# EAGLE design SBC (EAGLE 6.3)
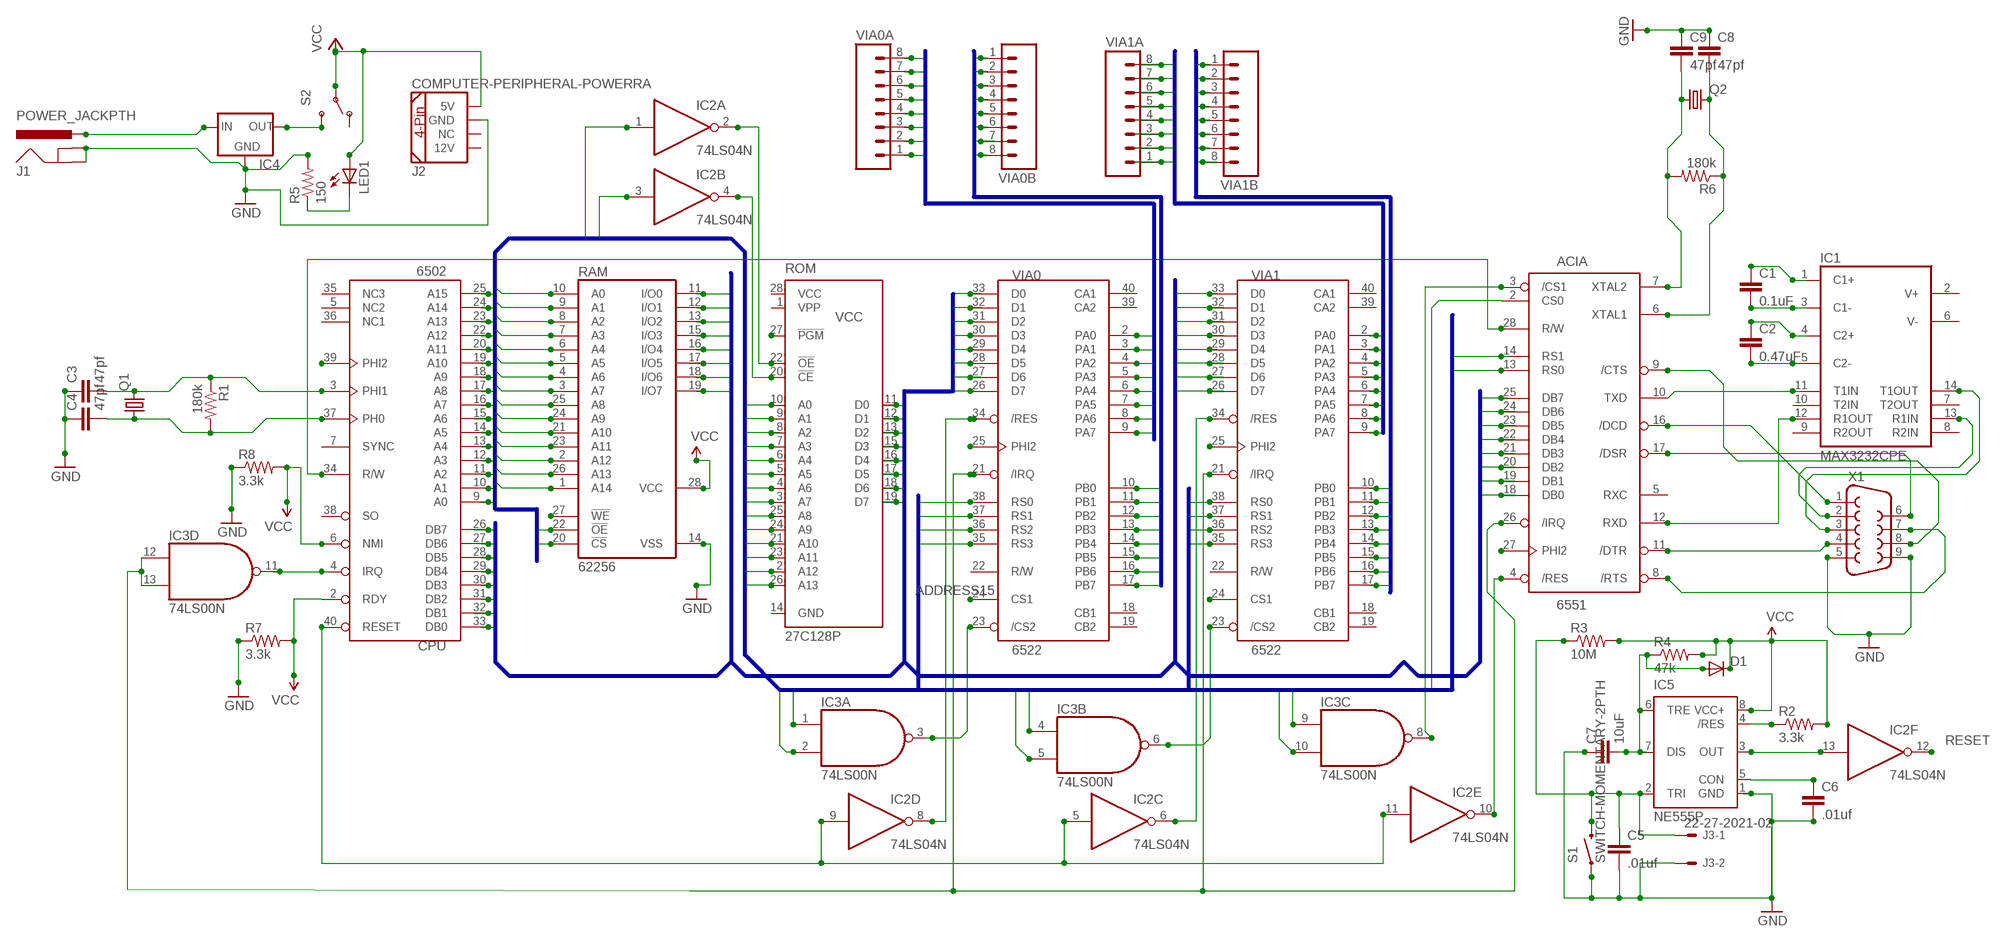
[diagram p0: schematic, sheet 1]

## Parts
ACIA  6551  [DIP28]
C1  0.1uF  CAPKIT  [CAP-PTH-SMALL-KIT]
C2  0.47uF  CAPKIT  [CAP-PTH-SMALL-KIT]
C3  47pf  CAPEZ  [CAP-PTH-SMALLEZ]
C4  47pf  CAPEZ  [CAP-PTH-SMALLEZ]
C5  .01uf  CAPEZ  [CAP-PTH-SMALLEZ]
C6  .01uf  CAPEZ  [CAP-PTH-SMALLEZ]
C7  10uF  CAPEZ  [CAP-PTH-SMALLEZ]
C8  47pf  CAPEZ  [CAP-PTH-SMALLEZ]
C9  47pf  CAPEZ  [CAP-PTH-SMALLEZ]
CPU  6502  [DIP40]
D1  DIODE1N4148  [DIODE-1N4148]
IC1  MAX3232CPE  [DIL16]
IC2  74LS04N  [DIL14]
IC3  74LS00N  [DIL14]
IC4  V_REG_78XX-TO-220  [TO-220-ALT]
IC5  NE555P  [DIL-08]
J1  POWER_JACKPTH  [POWER_JACK_PTH]
J2  COMPUTER-PERIPHERAL-POWERRA  [COMPUTER-PERIPHERAL-POWER-RA]
J3  22-27-2021-02  [6410-02]
LED1  LED3MM  [LED3MM]
Q1  CRYSTALHC49S  [HC49/S]
Q2  CRYSTALHC49S  [HC49/S]
R1  180k  RESISTOREZ  [AXIAL-0.3EZ]
R2  3.3k  RESISTORAXIAL-0.3  [AXIAL-0.3]
R3  10M  RESISTORAXIAL-0.3  [AXIAL-0.3]
R4  47k  RESISTORAXIAL-0.3  [AXIAL-0.3]
R5  150  RESISTOREZ  [AXIAL-0.3EZ]
R6  180k  RESISTOREZ  [AXIAL-0.3EZ]
R7  3.3k  RESISTOREZ  [AXIAL-0.3EZ]
R8  3.3k  RESISTOREZ  [AXIAL-0.3EZ]
RAM  62256  62256P  [DIL28-6]
ROM  27C128P  [DIL28-6]
S1  SWITCH-MOMENTARY-2PTH  [TACTILE-PTH]
S2  SWITCH-SPDTPTH_LOCK  [SWITCH-SPDT_LOCK.007S]
VIA0  6522  [DIP40]
VIA0A  M08LONGPADS  [1X08_LONGPADS]
VIA0B  M08LONGPADS  [1X08_LONGPADS]
VIA1  6522  [DIP40]
VIA1A  M08LONGPADS  [1X08_LONGPADS]
VIA1B  M08LONGPADS  [1X08_LONGPADS]
X1  DB9FEMALE  [DB9]

## Nets
65IRQ: CPU.4(IRQ) IC3.11(D:O)
ADDRESS0: ACIA.13(RS0) CPU.9(A0) RAM.10(A0) ROM.10(A0) VIA0.38(RS0) VIA1.38(RS0)
ADDRESS1: ACIA.14(RS1) CPU.10(A1) RAM.9(A1) ROM.9(A1) VIA0.37(RS1) VIA1.37(RS1)
ADDRESS2: CPU.11(A2) RAM.8(A2) ROM.8(A2) VIA0.36(RS2) VIA1.36(RS2)
ADDRESS3: CPU.12(A3) RAM.7(A3) ROM.7(A3) VIA0.35(RS3) VIA1.35(RS3)
ADDRESS4: CPU.13(A4) RAM.6(A4) ROM.6(A4)
ADDRESS5: CPU.14(A5) RAM.5(A5) ROM.5(A5)
ADDRESS6: CPU.15(A6) RAM.4(A6) ROM.4(A6)
ADDRESS7: CPU.16(A7) RAM.3(A7) ROM.3(A7)
ADDRESS8: CPU.17(A8) RAM.25(A8) ROM.25(A8)
ADDRESS9: CPU.18(A9) IC3.10(C:I1) RAM.24(A9) ROM.24(A9)
ADDRESS10: CPU.19(A10) IC3.5(B:I1) RAM.21(A10) ROM.21(A10)
ADDRESS11: CPU.20(A11) IC3.2(A:I1) RAM.23(A11) ROM.23(A11)
ADDRESS12: CPU.22(A12) IC3.1(A:I0) IC3.4(B:I0) IC3.9(C:I0) RAM.2(A12) ROM.2(A12)
ADDRESS13: CPU.23(A13) IC2.1(A:I) RAM.26(A13) ROM.26(A13)
ADDRESS14: CPU.24(A14) RAM.1(A14)
ADDRESS15: ACIA.2(CS0) CPU.25(A15) IC2.3(B:I) RAM.20(!CS) RAM.22(!OE) VIA0.24(CS1) VIA1.24(CS1)
CLEARTOSEND: ACIA.9(/CTS) X1.8
DATA0: ACIA.18(DB0) CPU.33(DB0) RAM.11(I/O0) ROM.11(D0) VIA0.33(D0) VIA1.33(D0)
DATA1: ACIA.19(DB1) CPU.32(DB1) RAM.12(I/O1) ROM.12(D1) VIA0.32(D1) VIA1.32(D1)
DATA2: ACIA.20(DB2) CPU.31(DB2) RAM.13(I/O2) ROM.13(D2) VIA0.31(D2) VIA1.31(D2)
DATA3: ACIA.21(DB3) CPU.30(DB3) RAM.15(I/O3) ROM.15(D3) VIA0.30(D3) VIA1.30(D3)
DATA4: ACIA.22(DB4) CPU.29(DB4) RAM.16(I/O4) ROM.16(D4) VIA0.29(D4) VIA1.29(D4)
DATA5: ACIA.23(DB5) CPU.28(DB5) RAM.17(I/O5) ROM.17(D5) VIA0.28(D5) VIA1.28(D5)
DATA6: ACIA.24(DB6) CPU.27(DB6) RAM.18(I/O6) ROM.18(D6) VIA0.27(D6) VIA1.27(D6)
DATA7: ACIA.25(DB7) CPU.26(DB7) RAM.19(I/O7) ROM.19(D7) VIA0.26(D7) VIA1.26(D7)
DATACARRIERDETECT: ACIA.16(/DCD) X1.1
DATASETREADY: ACIA.17(/DSR) X1.6
DTEREADY: ACIA.11(/DTR) X1.4
GND: C3.1 C4.1 C5.2 C6.2 C7.1 C8.1 C9.1 IC4.GND IC5.1(GND) J1.GND J1.GNDBREAK J2.GND J3.2 R5.P$2 R7.P$1 R8.P$1 RAM.14(VSS) S1.1 X1.5 X1.9
IRQ: ACIA.26(/IRQ) IC3.12(D:I0) IC3.13(D:I1) VIA0.21(/IRQ) VIA1.21(/IRQ)
N$1: LED1.K(C) R5.P$1
N$2: C3.2 CPU.3(PHI1) Q1.2 R1.P$1
N$3: IC1.14(T1OUT) X1.3
N$5: ACIA.28(R/W) CPU.34(R/W)
N$6: C5.1 IC5.2(TRI) J3.1 R3.P$1 S1.3
N$7: ACIA.10(TXD) IC1.11(T1IN)
N$8: ACIA.12(RXD) IC1.12(R1OUT)
N$9: C1.2 IC1.3(C1-)
N$10: C1.1 IC1.1(C1+)
N$11: C2.2 IC1.5(C2-)
N$12: C2.1 IC1.4(C2+)
N$13: IC2.4(B:O) ROM.20(!CE)
N$14: IC2.2(A:O) ROM.22(!OE)
N$15: IC3.6(B:O) VIA1.23(/CS2)
N$16: ACIA.3(/CS1) IC3.8(C:O)
N$17: IC3.3(A:O) VIA0.23(/CS2)
N$18: C4.2 CPU.37(PH0) Q1.1 R1.P$2
N$19: C6.1 IC5.5(CON)
N$20: IC4.IN J1.PWR
N$21: IC2.8(D:O) VIA0.34(/RES)
N$22: C7.2 D1.A IC5.6(TRE) IC5.7(DIS) R4.P$1
N$23: IC5.4(/RES) R2.P$1
N$24: IC2.6(C:O) VIA1.34(/RES)
N$26: ACIA.4(/RES) IC2.10(E:O)
N$29: IC2.13(F:I) IC5.3(OUT)
N$30: ACIA.6(XTAL1) C8.2 Q2.2 R6.P$1
N$31: ACIA.7(XTAL2) C9.2 Q2.1 R6.P$2
N$32: IC4.OUT S2.3(S)
PHI2: ACIA.27(PHI2) CPU.39(PHI2) RAM.27(!WE) VIA0.25(PHI2) VIA1.25(PHI2)
RECEIVEDATA: IC1.13(R1IN) X1.2
REQUESTTOSEND: ACIA.8(/RTS) X1.7
RESET: CPU.40(RESET) IC2.5(C:I) IC2.9(D:I) IC2.11(E:I) IC2.12(F:O)
VCC: CPU.2(RDY) CPU.6(NMI) D1.C IC5.8(VCC+) J2.5V LED1.A R2.P$2 R3.P$2 R4.P$2 R7.P$2 R8.P$2 RAM.28(VCC) ROM.27(!PGM) S2.2(P)
VIA0A0: VIA0.2(PA0) VIA0A.1
VIA0A1: VIA0.3(PA1) VIA0A.2
VIA0A2: VIA0.4(PA2) VIA0A.3
VIA0A3: VIA0.5(PA3) VIA0A.4
VIA0A4: VIA0.6(PA4) VIA0A.5
VIA0A5: VIA0.7(PA5) VIA0A.6
VIA0A6: VIA0.8(PA6) VIA0A.7
VIA0A7: VIA0.9(PA7) VIA0A.8
VIA0B0: VIA0.10(PB0) VIA0B.1
VIA0B1: VIA0.11(PB1) VIA0B.2
VIA0B2: VIA0.12(PB2) VIA0B.3
VIA0B3: VIA0.13(PB3) VIA0B.4
VIA0B4: VIA0.14(PB4) VIA0B.5
VIA0B5: VIA0.15(PB5) VIA0B.6
VIA0B6: VIA0.16(PB6) VIA0B.7
VIA0B7: VIA0.17(PB7) VIA0B.8
VIA1A0: VIA1.2(PA0) VIA1A.1
VIA1A1: VIA1.3(PA1) VIA1A.2
VIA1A2: VIA1.4(PA2) VIA1A.3
VIA1A3: VIA1.5(PA3) VIA1A.4
VIA1A4: VIA1.6(PA4) VIA1A.5
VIA1A5: VIA1.7(PA5) VIA1A.6
VIA1A6: VIA1.8(PA6) VIA1A.7
VIA1A7: VIA1.9(PA7) VIA1A.8
VIA1B0: VIA1.10(PB0) VIA1B.1
VIA1B1: VIA1.11(PB1) VIA1B.2
VIA1B2: VIA1.12(PB2) VIA1B.3
VIA1B3: VIA1.13(PB3) VIA1B.4
VIA1B4: VIA1.14(PB4) VIA1B.5
VIA1B5: VIA1.15(PB5) VIA1B.6
VIA1B6: VIA1.16(PB6) VIA1B.7
VIA1B7: VIA1.17(PB7) VIA1B.8
Unconnected: ACIA.5(RXC) CPU.5(NC2) CPU.7(SYNC) CPU.35(NC3) CPU.36(NC1) CPU.38(SO) IC1.2(V+) IC1.6(V-) IC1.7(T2OUT) IC1.8(R2IN) IC1.9(R2OUT) IC1.10(T2IN) J2.12V J2.NC ROM.1(VPP) S2.1(O) VIA0.18(CB1) VIA0.19(CB2) VIA0.22(R/W) VIA0.39(CA2) VIA0.40(CA1) VIA1.18(CB1) VIA1.19(CB2) VIA1.22(R/W) VIA1.39(CA2) VIA1.40(CA1)

## Buses
VIA0A[0..7]
VIA0B[0..7]
VIA1A[0..7]
VIA1B[0..7]
ADDRESS[0..15]
DATA[0..7]

## Power pins joined to a net without a drawn wire
GND: ACIA.1(GND) CPU.1(GND) CPU.21(GND) IC1.15(GND) IC2.7(P:GND) IC3.7(P:GND) ROM.14(GND) VIA0.1(GND) VIA1.1(GND)
VCC: ACIA.15(VCC) CPU.8(VCC) IC1.16(VCC) IC2.14(P:VCC) IC3.14(P:VCC) ROM.28(VCC) VIA0.20(VCC) VIA1.20(VCC)

## Library data of the parts
ACIA = 0RB_65xx:6551: ACIA. Capable of RS-232
C1-C9 = SparkFun-Capacitors:CAP: Capacitor Standard 0603 ceramic capacitor, and 0.1" leaded capacitor.
CPU = 0RB_65xx:6502: 6502 processor
D1 = SparkFun-DiscreteSemi:DIODE: Diode These are standard reverse protection diodes and small signal diodes. SMA package can handle up to about 1A. SOD-323 can handle about 200mA. What the SOD-323 package when ordering, there are some mfgs out there that are 5-pin packages.
IC1 = maxim:MAX3232*: True RS-232 Transceivers 3.0V to 5.5V, Low-Power up to 1Mbps, Using Four 0.1µF External Capacitors Source: http://pdfserv.maxim-ic.com/en/ds/MAX3222-MAX3241.pdf; MF: MAXIM; MPN: MAX3232CPE+; OC_FARNELL: 9724494; OC_NEWARK: 68K4626
IC2 = 74xx-us:74*04: Hex INVERTER
IC3 = 74xx-us:74*00: Quad 2-input NAND gate
IC4 = SparkFun-PowerIC:V_REG_78XX: Voltage Regulator Standard 7805 5V regulator. IGO (Input Ground Output). Spark Fun Electronics SKU : COM-00107
IC5 = SparkFun-AnalogIC:NE555: General purpose bipolar Timer; MF: Arrow Electronics; MPN: NE555N; OC_FARNELL: 1467742; OC_NEWARK: 89K1486
J1 = SparkFun-Connectors:POWER_JACK: Power Jack This is the standard 5.5mm barrel jack for power. The PTH is the most common, proven, reliable, footprint. The Slot footprint only works if the mill layer is transmitted to the PCB fab house so be warned. Spark Fun Electronics SKU : PRT-00119 SMT: CONN-08106 Mating wall wart : TOL-00298 (and others)
J2 = SparkFun-Connectors:COMPUTER-PERIPHERAL-POWER
J3 = con-molex:22-?-02: CONNECTOR wire to board 2.54 mm (.1 inch) pitch header; OC_FARNELL: unknown; OC_NEWARK: unknown
LED1 = led:LED: LED OSRAM: - CHIPLED LG R971, LG N971, LY N971, LG Q971, LY Q971, LO R971, LY R971 LH N974, LH R974 LS Q976, LO Q976, LY Q976 LO Q996 - Hyper CHIPLED LW Q18S LB Q993, LB Q99A, LB R99A - SideLED LS A670, LO A670, LY A670, LG A670, LP A670 LB A673, LV A673, LT A673, LW A673 LH A674 LY A675 LS A676, LA A676, LO A676, LY A676, LW A676 LS A679, LY A679, LG A679 - Hyper Micro SIDELED® LS Y876, LA Y876, LO Y876, LY Y876 LT Y87S - SmartLED LW L88C, LW L88S LB L89C, LB L89S, LG L890 LS L89K, LO L89K, LY L89K LS L896, LA L896, LO L896, LY L896 - TOPLED LS T670, LO T670, LY T670, LG T670, LP T670 LSG T670, LSP T670, LSY T670, LOP T670, LYG T670 LG T671, LOG T671, LSG T671 LB T673, LV T673, LT T673, LW T673 LH T674 LS T676, LA T676, LO T676, LY T676, LB T676, LH T676, LSB T676, LW T676 LB T67C, LV T67C, LT T67C, LS T67K, LO T67K, LY T67K, LW E67C LS E67B, LA E67B, LO E67B, LY E67B, LB E67C, LV E67C, LT E67C LW T67C LS T679, LY T679, LG T679 LS T770, LO T770, LY T770, LG T770, LP T770 LB T773, LV T773, LT T773, LW T773 LH T774 LS E675, LA E675, LY E675, LS T675 LS T776, LA T776, LO T776, LY T776, LB T776 LHGB T686 LT T68C, LB T68C - Hyper Mini TOPLED® LB M676 - Mini TOPLED Santana® LG M470 LS M47K, LO M47K, LY M47K Source: http://www.osram.convergy.de LUXEON: - LUMILED® LXK2-PW12-R00, LXK2-PW12-S00, LXK2-PW14-U00, LXK2-PW14-V00 LXK2-PM12-R00, LXK2-PM12-S00, LXK2-PM14-U00 LXK2-PE12-Q00, LXK2-PE12-R00, LXK2-PE12-S00, LXK2-PE14-T00, LXK2-PE14-U00 LXK2-PB12-K00, LXK2-PB12-L00, LXK2-PB12-M00, LXK2-PB14-N00, LXK2-PB14-P00, LXK2-PB14-Q00 LXK2-PR12-L00, LXK2-PR12-M00, LXK2-PR14-Q00, LXK2-PR14-R00 LXK2-PD12-Q00, LXK2-PD12-R00, LXK2-PD12-S00 LXK2-PH12-R00, LXK2-PH12-S00 LXK2-PL12-P00, LXK2-PL12-Q00, LXK2-PL12-R00 Source: www.luxeon.com KINGBRIGHT: KA-3528ASYC Source: www.kingbright.com
Q1 Q2 = crystal:CRYSTAL: CRYSTAL; OC_FARNELL: 1667008; OC_NEWARK: unknown
R1 R5 R6 = SparkFun-Passives:RESISTOR: Resistor Basic schematic elements and footprints for 0603, 1206, and PTH resistors.
R2-R4 R7 R8 = SparkFun-Resistors:RESISTOR: Resistor Basic schematic elements and footprints for 0603, 1206, and PTH resistors.
RAM = memory-hitachi:62256P: MEMORY; OC_FARNELL: unknown; OC_NEWARK: unknown
ROM = microchip:27*128: CMOS EPROM 128 K (16 K x 8); OC_FARNELL: unknown; OC_NEWARK: unknown
S1 = SparkFun-Electromechanical:SWITCH-MOMENTARY-2: Various NO switches- pushbuttons, reed, etc
S2 = SparkFun-Electromechanical:SWITCH-SPDT: SPDT Switch Simple slide switch, Spark Fun Electronics SKU : COM-00102 DPDT SMT slide switch, AYZ0202, SWCH-08179
VIA0 VIA1 = 0RB_65xx:6522: I/O device: two 8-bits ports, handshake lines, timers.
VIA0A VIA0B VIA1A VIA1B = SparkFun-Connectors:M08: Header 8 Standard 8-pin 0.1" header. Use with straight break away headers (SKU : PRT-00116), right angle break away headers (PRT-00553), swiss pins (PRT-00743), machine pins (PRT-00117), and female headers (PRT-00115).
X1 = SparkFun-Connectors:DB9: DB9 Connector Standard DB9 (D-Sub 9) serial connector. Can be used for CAN bus as well as RS485 and RS232. Footprint production proven. Spark Fun Electronics SKU : PRT-00429

## Board
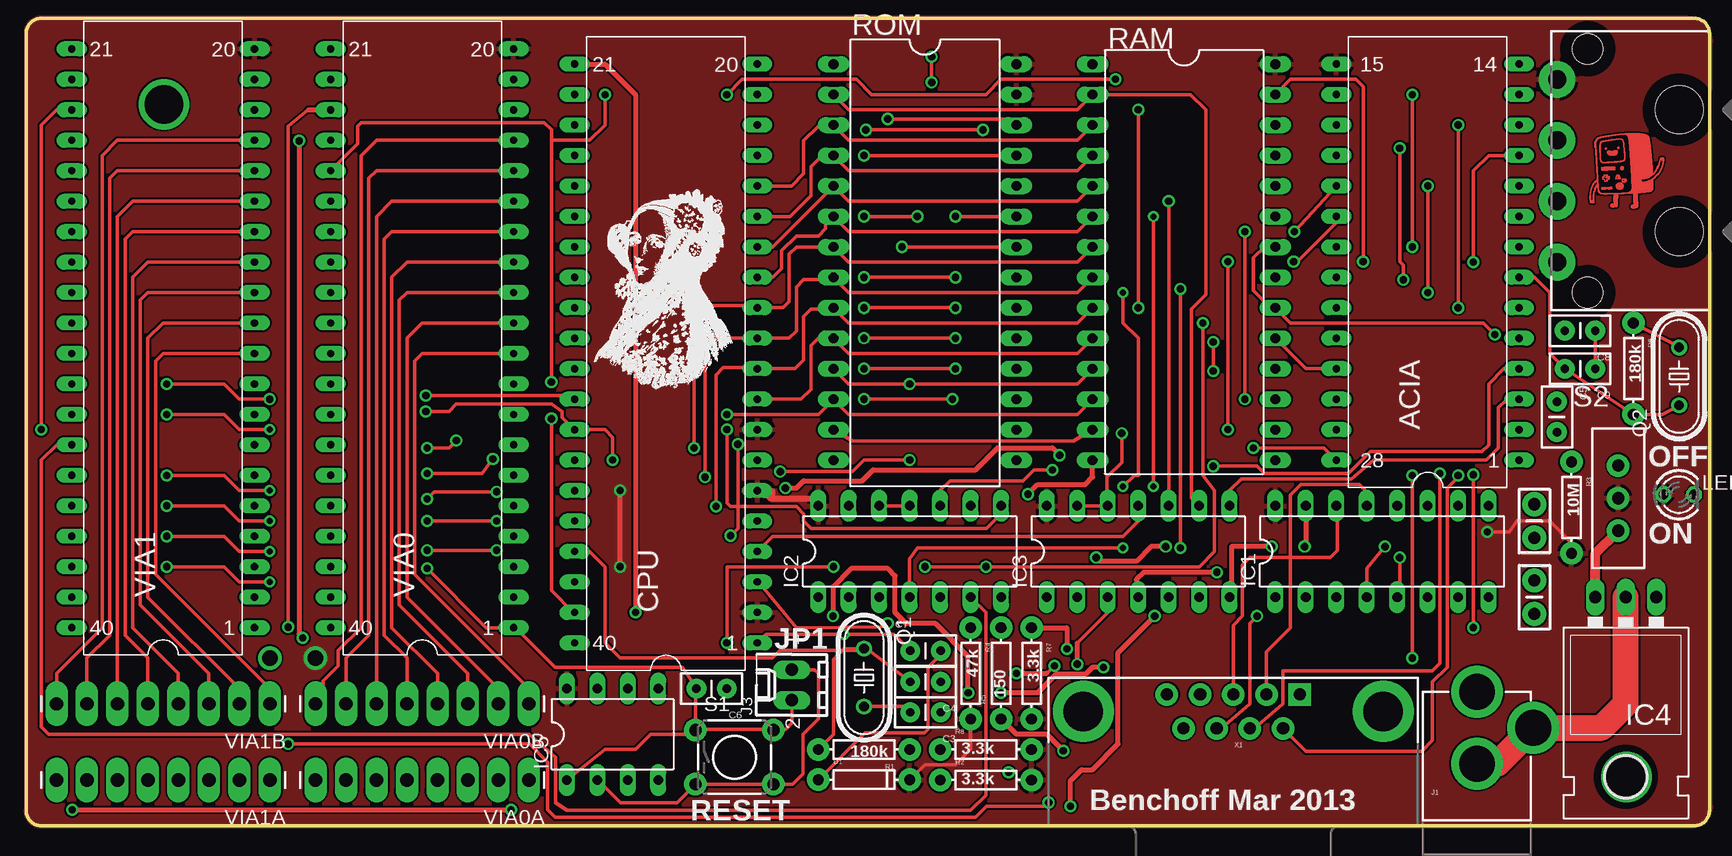
[diagram p1: board, top side]
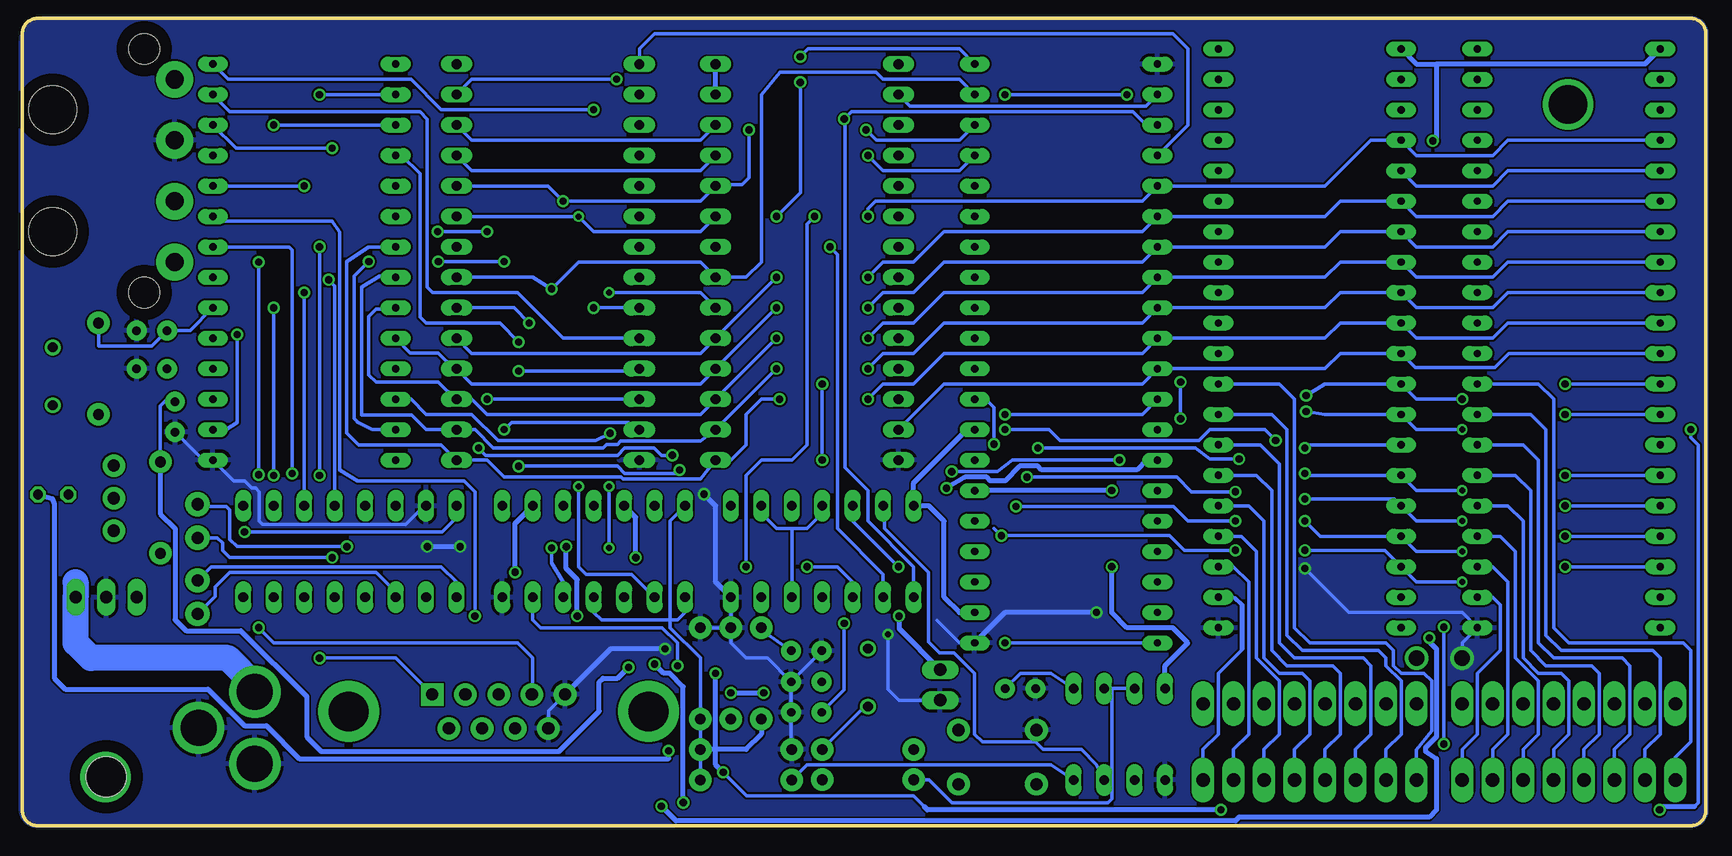
[diagram p2: board, bottom side, seen from below]

No outline drawn. Coordinates in mm, seen from the top.
Copper layers (1*16): Top 0.035mm / dielectric 1.5mm / Bottom 0.035mm
Design rules "default *": minimum track width 6mil, minimum drill 12mil, track to track 6mil, track to pad 6mil, pad to pad 6mil, via to via 6mil, smd to smd 6mil, copper to edge 40mil, drill to drill 8mil, minimum pad ring 10mil, minimum via ring 8mil, stop-mask expansion 4mil, vias tented up to drill 0mil, thermal gap 10mil
Milling: 8 lines

### Footprints (pad centres in the part's own frame; a part is rotated, then mirrored left to right if it is on the bottom)
DIP28 = drill 0.61 pad 1.27 long: 1 -16.51,-7.62; 2 -13.97,-7.62; 3 -11.43,-7.62; 4 -8.89,-7.62; 5 -6.35,-7.62; 6 -3.81,-7.62; 7 -1.27,-7.62; 8 1.27,-7.62; 9 3.81,-7.62; 10 6.35,-7.62; 11 8.89,-7.62; 12 11.43,-7.62; 13 13.97,-7.62; 14 16.51,-7.62; 15 16.51,7.62; 16 13.97,7.62; 17 11.43,7.62; 18 8.89,7.62; 19 6.35,7.62; 20 3.81,7.62; 21 1.27,7.62; 22 -1.27,7.62; 23 -3.81,7.62; 24 -6.35,7.62; 25 -8.89,7.62; 26 -11.43,7.62; 27 -13.97,7.62; 28 -16.51,7.62
CAP-PTH-SMALL-KIT = drill 1.016 pad 2.032: 1 -1.397,0; 2 1.397,0
CAP-PTH-SMALLEZ = drill 0.7 pad 1.651: 1 0,0; 2 2.54,0
DIP40 = drill 0.61 pad 1.27 long: 1 -24.13,-7.62; 2 -21.59,-7.62; 3 -19.05,-7.62; 4 -16.51,-7.62; 5 -13.97,-7.62; 6 -11.43,-7.62; 7 -8.89,-7.62; 8 -6.35,-7.62; 9 -3.81,-7.62; 10 -1.27,-7.62; 11 1.27,-7.62; 12 3.81,-7.62; 13 6.35,-7.62; 14 8.89,-7.62; 15 11.43,-7.62; 16 13.97,-7.62; 17 16.51,-7.62; 18 19.05,-7.62; 19 21.59,-7.62; 20 24.13,-7.62; 21 24.13,7.62; 22 21.59,7.62; 23 19.05,7.62; 24 16.51,7.62; 25 13.97,7.62; 26 11.43,7.62; 27 8.89,7.62; 28 6.35,7.62; 29 3.81,7.62; 30 1.27,7.62; 31 -1.27,7.62; 32 -3.81,7.62; 33 -6.35,7.62; 34 -8.89,7.62; 35 -11.43,7.62; 36 -13.97,7.62; 37 -16.51,7.62; 38 -19.05,7.62; 39 -21.59,7.62; 40 -24.13,7.62
DIODE-1N4148 = drill 0.9 pad 1.88: A -3.81,0; C 3.81,0
DIL16 = drill 0.813 long: 1 -8.89,-3.81; 2 -6.35,-3.81; 3 -3.81,-3.81; 4 -1.27,-3.81; 5 1.27,-3.81; 6 3.81,-3.81; 7 6.35,-3.81; 8 8.89,-3.81; 9 8.89,3.81; 10 6.35,3.81; 11 3.81,3.81; 12 1.27,3.81; 13 -1.27,3.81; 14 -3.81,3.81; 15 -6.35,3.81; 16 -8.89,3.81
DIL14 = drill 0.813 long: 1 -7.62,-3.81; 2 -5.08,-3.81; 3 -2.54,-3.81; 4 0,-3.81; 5 2.54,-3.81; 6 5.08,-3.81; 7 7.62,-3.81; 8 7.62,3.81; 9 5.08,3.81; 10 2.54,3.81; 11 0,3.81; 12 -2.54,3.81; 13 -5.08,3.81; 14 -7.62,3.81
TO-220-ALT = drill 1.016 long: GND 0,-3.81; IN -2.54,-3.81; OUT 2.54,-3.81 | hole 3.302: 0,11.176
DIL-08 = drill 0.813 long: 1 -3.81,-3.81; 2 -1.27,-3.81; 3 1.27,-3.81; 4 3.81,-3.81; 5 3.81,3.81; 6 1.27,3.81; 7 -1.27,3.81; 8 -3.81,3.81
POWER_JACK_PTH = drill 2.997 pad 4.318: GND 0,7.7; GNDBREAK 4.7,10.7; PWR 0,13.7
COMPUTER-PERIPHERAL-POWER-RA = drill 1.524 pad 3.048: 5V -7.62,-2.54; 12V 7.62,-2.54; GND -2.54,-2.54; NC 2.54,-2.54 | hole 2.54: -10.16,0; 10.16,0 | hole 3.988: -5.08,7.62; 5.08,7.62
6410-02 = drill 1.016 long: 1 1.27,0; 2 -1.27,0
LED3MM = drill 0.813 octagon: A -1.27,0; K 1.27,0
HC49/S = drill 0.813: 1 -2.413,0; 2 2.413,0
AXIAL-0.3EZ = drill 0.9 pad 1.88: P$1 -3.81,0; P$2 3.81,0
AXIAL-0.3 = drill 0.9 pad 1.88: P$1 -3.81,0; P$2 3.81,0
DIL28-6 = drill 0.813 long: 1 -16.51,-7.62; 2 -13.97,-7.62; 3 -11.43,-7.62; 4 -8.89,-7.62; 5 -6.35,-7.62; 6 -3.81,-7.62; 7 -1.27,-7.62; 8 1.27,-7.62; 9 3.81,-7.62; 10 6.35,-7.62; 11 8.89,-7.62; 12 11.43,-7.62; 13 13.97,-7.62; 14 16.51,-7.62; 15 16.51,7.62; 16 13.97,7.62; 17 11.43,7.62; 18 8.89,7.62; 19 6.35,7.62; 20 3.81,7.62; 21 1.27,7.62; 22 -1.27,7.62; 23 -3.81,7.62; 24 -6.35,7.62; 25 -8.89,7.62; 26 -11.43,7.62; 27 -13.97,7.62; 28 -16.51,7.62
TACTILE-PTH = drill 1.016 pad 1.88: 1 -3.251,2.261; 2 3.251,2.261; 3 -3.251,-2.261; 4 3.251,-2.261
SWITCH-SPDT_LOCK.007S = drill 1.016 pad 1.88: 1 0,2.718; 2 0,0; 3 0,-2.718
1X08_LONGPADS = drill 1.118 pad 1.88 long: 1 0,0; 2 2.54,0; 3 5.08,0; 4 7.62,0; 5 10.16,0; 6 12.7,0; 7 15.24,0; 8 17.78,0
DB9 = drill 1.016 pad 1.88 square: 1 -5.54,-1.42 | drill 1.016 pad 1.88: 2 -2.77,-1.42; 3 0,-1.42; 4 2.77,-1.42; 5 5.54,-1.42; 6 -4.15,1.42; 7 -1.38,1.42; 8 1.38,1.42; 9 4.15,1.42 | drill 3.302 pad 5.08: G1 -12.5,0; G2 12.5,0

### Placement (x,y rotation side)
ACIA  203.2,68.58 90 top
C1  212.09,40.64 270 top
C2  212.09,46.99 270 top
C3  162.61,31.04 180 top
C4  162.61,33.58 180 top
C5  213.97,56.95 270 top
C6  144.78,33.02 180 top
C7  160.07,36.17 0 top
C8  217.17,62.87 180 top
C9  217.17,59.69 180 top
CPU  139.7,60.96 90 top
D1  156.21,25.43 0 top
IC1  199.39,44.45 0 top
IC2  160.02,44.45 0 top
IC3  179.07,44.45 0 top
IC4  219.71,36.83 180 top
IC5  135.25,29.21 0 top
J1  207.31,19.05 0 top
J2  216.53,76.2 270 top
J3  150.19,33.32 90 top
LED1  224.13,49.2 0 top
Q1  156.21,33.93 270 top
Q2  224.16,59.05 90 top
R1  156.21,27.94 180 top
R2  166.37,25.4 0 top
R3  215.19,48.11 270 top
R4  165.1,34.29 270 top
R5  167.64,34.29 90 top
R6  220.34,59.69 270 top
R7  170.18,34.29 270 top
R8  166.37,27.94 0 top
RAM  182.88,68.58 270 top
ROM  161.29,68.58 270 top
S1  145.41,27.3 0 top
S2  219.07,48.9 0 top
VIA0  119.38,62.23 90 top
VIA0A  128.27,25.4 180 top
VIA0B  128.27,31.75 180 top
VIA1  97.79,62.23 90 top
VIA1A  106.68,25.4 180 top
VIA1B  106.68,31.75 180 top
X1  186.99,31.11 180 top

### Tracks (layer width: path | path; a pad name or v marks a point on that pad's centre or on a via)
65IRQ
  Top 0.305: IC3.11 179.07,46.99 177.8,45.72 148.59,45.72 CPU.4
ADDRESS0  (via drill 0.5, 0.6)
  Top 0.305: RAM.10 173.99,60.96 154.94,60.96 ROM.10 152.4,62.23 151.79,61.62 151.79,57.96 150.98,57.15 CPU.9 | v98.09,43.18 102.87,43.18 104.14,41.91 v106.68,41.91 | v125.58,44.55 v119.79,44.55 | v145.69,53.39 145.69,46.38 v145.09,45.77
  Bottom 0.305: VIA1.38 v98.09,43.18 | 145.69,46.38 v145.09,45.77 131.06,45.77 129.84,44.55 v125.58,44.55 | CPU.9 146.41,57.15 145.69,56.44 v145.69,53.39 | v119.79,44.55 113.13,44.55 VIA0.38 110.49,41.91 v106.68,41.91 | RAM.10 181.61,62.23 185.42,66.04 192.48,66.04 192.94,66.5 192.94,80.52 193.55,81.13 209.4,81.13 ACIA.13
ADDRESS1  (via drill 0.5, 0.6)
  Top 0.305: RAM.9 173.99,63.5 154.94,63.5 ROM.9 153.57,64.67 151.79,64.67 151.18,64.06 151.18,60.4 150.47,59.69 CPU.10 147.22,59.79 144.47,59.79 143.87,59.18 v143.87,48.21 | v98.09,45.72 102.87,45.72 104.14,44.45 v106.68,44.45 | v125.58,46.99 v119.79,46.99 | v179.07,64.77 v179.07,81.28
  Bottom 0.305: VIA1.37 v98.09,45.72 | v143.87,48.21 130.76,48.21 129.54,46.99 v125.58,46.99 | v119.79,46.99 118.52,45.72 VIA0.37 110.49,44.45 v106.68,44.45 | RAM.9 v179.07,64.77 | v179.07,81.28 191.77,81.28 194.31,83.82 209.55,83.82 ACIA.14
ADDRESS2  (via drill 0.5, 0.6)
  Top 0.305: RAM.8 173.99,66.04 154.94,66.04 ROM.8 153.47,67.11 151.18,67.11 150.57,66.5 150.57,62.84 149.96,62.23 CPU.11 143.56,62.23 142.95,61.62 v142.95,50.65 | v98.09,48.26 102.87,48.26 104.14,46.99 v106.68,46.99 | v119.79,48.82 120.4,49.43 v125.58,49.43
  Bottom 0.305: VIA1.36 v98.09,48.26 | v119.79,48.82 112.32,48.82 VIA0.36 110.49,46.99 v106.68,46.99 | v125.58,49.43 129.24,49.43 130.45,50.65 v142.95,50.65
ADDRESS3  (via drill 0.5, 0.6)
  Top 0.305: RAM.7 173.99,68.58 154.94,68.58 ROM.7 150.57,69.85 149.96,69.24 149.96,65.28 149.45,64.77 CPU.12 147.12,64.97 142.65,64.97 142.04,64.36 v142.04,53.09 | v98.09,50.8 102.87,50.8 104.14,49.53 v106.68,49.53 | v119.79,50.95 124.36,50.95 v125.27,52.17
  Bottom 0.305: VIA1.35 v98.09,50.8 | v119.79,50.95 119.63,50.8 VIA0.35 110.49,49.53 v106.68,49.53 | v125.27,52.17 127.71,52.17 128.93,53.09 v142.04,53.09
ADDRESS4
  Top 0.305: RAM.6 173.99,71.12 154.94,71.12 ROM.6 153.01,71.73 153.01,71.37 152.4,70.76 150.57,70.76 149.35,69.55 149.35,68.02 148.64,67.31 CPU.13
ADDRESS5
  Top 0.305: RAM.5 173.99,73.66 154.94,73.66 ROM.5 148.59,69.85 CPU.14
ADDRESS6
  Top 0.305: RAM.4 173.99,76.2 154.94,76.2 ROM.4 152.71,77.47 151.79,76.56 151.79,74.12 150.06,72.39 CPU.15
ADDRESS7
  Top 0.305: RAM.3 173.99,78.74 154.94,78.74 ROM.3 153.57,79.91 152.4,79.91 151.18,78.69 151.18,75.95 150.16,74.93 CPU.16
ADDRESS8  (via drill 0.6)
  Top 0.305: v156.21,77.47 ROM.25
  Bottom 0.305: RAM.25 189.23,76.2 170.18,76.2 ROM.25 | CPU.17 148.59,76.2 154.94,76.2 v156.21,77.47
ADDRESS9  (via drill 0.6)
  Top 0.305: v181.61,73.66 IC3.10 | v156.36,79.6 v166.12,79.6
  Bottom 0.305: RAM.24 182.88,74.93 v181.61,73.66 170.18,73.66 ROM.24 168.81,75.03 166.73,75.03 166.12,75.64 v166.12,79.6 | CPU.18 148.59,78.74 155.5,78.74 v156.36,79.6
ADDRESS10  (via drill 0.6)
  Top 0.305: v182.57,44.76 v182.57,66.34
  Bottom 0.305: IC3.5 181.61,41.91 182.57,43.48 v182.57,44.76 | RAM.21 184.15,67.31 v182.57,66.34 180.34,68.58 170.18,68.58 ROM.21 166.37,67.31 165.1,68.58 165.1,82.55 163.53,84.43 155.55,84.43 154.94,83.82 148.59,83.82 CPU.19
ADDRESS11  (via drill 0.5, 0.6)
  Top 0.305: v180.34,49.86 v180.34,72.39 | v161.85,85.7 v161.85,83.57 | v163.83,72.39 ROM.23
  Bottom 0.305: IC3.2 175.9,42.55 179.71,42.55 180.34,43.18 v180.34,49.86 | RAM.23 v180.34,72.39 179.07,71.12 170.18,71.12 ROM.23 | CPU.20 148.59,86.36 161.19,86.36 v161.85,85.7 | v161.85,83.57 161.85,74.37 v163.83,72.39
ADDRESS12  (via drill 0.6)
  Top 0.305: ROM.2 154.94,81.28 173.99,81.28 RAM.2 183.44,82.55 184.71,81.28 184.71,65.89 183.49,64.67 183.49,48.92 IC3.9
  Top 0.406: v185.62,42.72 179.53,42.72 178.92,42.11 178.92,40.79 IC3.4
  Bottom 0.305: IC3.1 171.45,39.37 172.09,38.73 178.44,38.73 179.07,39.37 IC3.4 | CPU.22 133.04,81.58 152.71,81.58 ROM.2
  Bottom 0.406: v185.62,42.72 185.62,46.79 IC3.9
ADDRESS13  (via drill 0.6)
  Top 0.305: v158.19,80.52 168.4,80.52 ROM.26
  Bottom 0.305: IC2.1 152.4,43.18 156.21,46.99 156.21,49.53 158.12,51.44 158.12,80.44 v158.19,80.52 157.58,81.13 134.11,81.13 132.99,80.01 CPU.23 | RAM.26 189.23,78.74 170.18,78.74 ROM.26
ADDRESS14
  Bottom 0.305: CPU.24 129.54,80.01 129.54,86.36 130.81,87.63 173.99,87.63 175.26,86.36 RAM.1
ADDRESS15  (via drill 0.6)
  Top 0.305: v184.46,63.5 184.46,50.8 185.42,49.53 185.42,44.45 184.15,43.18 v166.37,43.18 v161.29,43.18 | v160.66,72.39 v156.21,72.39 | RAM.22 189.59,69.85 188.67,68.94 188.67,66.19 190.09,64.77 RAM.20 191.77,63.5 207.82,63.5 v208.79,62.53
  Bottom 0.305: RAM.20 185.72,64.77 v184.46,63.5 | IC2.3 157.48,41.91 158.75,43.18 v161.29,43.18 | VIA1.24 102.87,78.74 104.14,77.47 110.49,77.47 VIA0.24 114.3,78.74 118.11,74.93 CPU.25 133.35,73.66 155.57,73.66 156.21,73.03 v156.21,72.39 | v166.37,43.18 166.37,50.8 165.1,52.07 162.56,52.07 161.29,53.34 161.29,71.75 v160.66,72.39 | v208.79,62.53 208.79,55.22 209.7,54.61 ACIA.2
CLEARTOSEND  (via drill 0.6)
  Top 0.305: X1.8 186.01,29.7 188.37,31.75 188.37,38.46 v188.98,39.06
  Bottom 0.305: v188.98,39.06 188.98,49.43 189.89,50.34 198.73,50.34 200.25,51.26 200.25,71.07 200.86,71.98 210.41,71.98 ACIA.9
DATA0  (via drill 0.5, 0.6)
  Top 0.305: RAM.11 173.99,58.42 v160.02,58.42 154.94,58.42 ROM.11 | v98.09,55.88 102.87,55.88 104.14,54.61 v106.68,54.61 | v119.69,56.13 121.61,56.13 122.22,56.74 130.15,56.74 131.06,56.13 131.06,55.63 CPU.33 134.62,54.61 135.25,53.98 v135.25,52.07 | v185.32,61.92 v185.32,59.49 | v160.02,52.07 156.21,52.07 155.25,51.1 v149.22,51.1
  Bottom 0.305: VIA1.33 v98.09,55.88 | v119.69,56.13 118.11,55.88 VIA0.33 110.49,54.61 v106.68,54.61 | ACIA.18 195.07,77.47 193.55,75.95 193.55,64.01 193.04,63.5 186.89,63.5 v185.32,61.92 | v185.32,59.49 175.46,59.49 RAM.11 | v160.02,58.42 v160.02,52.07 | v149.22,51.1 145.41,51.1 144.15,52.07 v135.25,52.07
DATA1  (via drill 0.6)
  Top 0.305: RAM.12 173.99,55.88 154.94,55.88 ROM.12 152.4,55.88 v144.78,55.88 | v98.09,58.42 102.87,58.42 104.14,57.15 v106.68,57.15 | v119.69,57.45 131.78,57.45 CPU.32 | ACIA.19 v192.07,71.12 | v187.96,71.12 v187.96,57.15
  Bottom 0.305: VIA1.32 v98.09,58.42 | v119.69,57.45 118.11,58.42 VIA0.32 110.49,57.15 v106.68,57.15 | v144.78,55.88 133.35,55.88 CPU.32 | v192.07,71.12 v187.96,71.12 | v187.96,57.15 RAM.12
DATA2  (via drill 0.6)
  Top 0.305: ROM.13 155.25,53.65 173.69,53.65 RAM.13 | ACIA.20 195.58,71.88 192.33,68.63 v192.02,68.63 | v186.54,68.63 v186.54,54.61
  Bottom 0.305: VIA1.31 102.77,60.96 103.94,59.79 110.59,59.79 VIA0.31 116.84,60.96 118.11,59.69 CPU.31 133.35,58.42 149.86,58.42 ROM.13 | v192.02,68.63 v186.54,68.63 | RAM.13 175.56,54.61 176.17,55.22 185.93,55.22 v186.54,54.61
DATA3  (via drill 0.6)
  Top 0.305: v156.21,57.15 v163.58,57.15
  Bottom 0.305: VIA1.30 102.87,63.5 104.14,62.23 110.49,62.23 VIA0.30 116.84,63.5 118.11,62.23 CPU.30 133.35,60.96 149.86,60.96 152.4,58.42 154.94,58.42 v156.21,57.15 | 167.74,52.07 ROM.15 | v163.58,57.15 165.1,57.15 166.37,55.88 166.37,53.34 167.64,52.07 ROM.15 | ACIA.21 197.81,69.85 199.67,68.61 199.67,54.33 198.68,53.34 191.77,53.34 RAM.15 187.96,52.07 186.54,50.65 176.78,50.65 176.63,50.49 170.18,50.49 ROM.15
DATA4  (via drill 0.6)
  Top 0.305: v156.21,59.69 v163.83,59.69
  Bottom 0.305: VIA1.29 102.87,66.04 104.14,64.77 110.49,64.77 VIA0.29 116.84,66.04 118.11,64.77 CPU.29 133.35,63.5 149.86,63.5 152.4,60.96 154.94,60.96 v156.21,59.69 | v163.83,59.69 ROM.16 170.18,53.65 176.84,53.65 177.09,53.39 178,53.39 178.31,53.09 187.45,53.09 188.98,54.61 RAM.16 193.04,54.61 194.26,55.83 198.43,55.83 198.43,66.5 196.9,67.41 195.68,67.41 ACIA.22
DATA5  (via drill 0.6)
  Top 0.305: v163.83,62.23 v156.21,62.23
  Bottom 0.305: VIA1.28 102.87,68.58 104.14,67.31 110.49,67.31 VIA0.28 116.84,68.58 118.11,67.31 CPU.28 133.35,66.04 149.86,66.04 152.4,63.5 154.94,63.5 v156.21,62.23 | v163.83,62.23 ROM.17 170.18,55.88 187.96,55.88 189.23,57.15 RAM.17 190.6,57.15 192.02,58.57 197.21,58.57 197.81,59.18 197.81,64.06 197.21,64.67 195.68,64.67 ACIA.23
DATA6  (via drill 0.6)
  Top 0.305: v156.21,64.77 v163.83,64.77
  Bottom 0.305: VIA1.27 102.87,71.12 104.14,69.85 110.49,69.85 VIA0.27 116.84,71.12 118.11,69.85 CPU.27 133.35,68.58 149.86,68.58 152.4,66.04 154.94,66.04 v156.21,64.77 | v163.83,64.77 ROM.18 170.18,58.42 189.23,58.42 RAM.18 190.7,59.69 192.02,61.01 194.36,61.01 ACIA.24
DATA7  (via drill 0.6)
  Top 0.305: v156.21,67.31 v163.83,67.31 | ACIA.25 193.04,59.69 RAM.19
  Bottom 0.305: VIA1.26 102.87,73.66 104.14,72.39 110.49,72.39 VIA0.26 116.84,73.66 118.11,72.39 CPU.26 133.35,71.12 149.86,71.12 152.4,68.58 154.94,68.58 v156.21,67.31 | RAM.19 189.23,60.96 170.18,60.96 ROM.19 v163.83,67.31
DATACARRIERDETECT  (via drill 0.6)
  Top 0.305: v201.93,35.56 v201.93,50.8 | v201.93,69.85 v201.93,82.55
  Bottom 0.305: X1.1 192.56,32.53 195.58,35.56 v201.93,35.56 | v201.93,50.8 v201.93,69.85 | v201.93,82.55 ACIA.16
DATASETREADY  (via drill 0.6)
  Top 0.305: v205.74,80.01 v205.74,64.77 | v205.74,50.8 205.74,50.65 204.83,49.73 204.83,34.8 203.61,33.58 203.61,28.7 202.69,27.79 193.05,27.79 X1.6
  Bottom 0.305: ACIA.17 v205.74,80.01 | v205.74,64.77 v205.74,50.8
DTEREADY  (via drill 0.6)
  Top 0.305: ACIA.11 208.28,77.47 207.01,76.2 v207.01,68.58 | v207.01,50.85 v207.01,38.1
  Bottom 0.305: v207.01,68.58 v207.01,50.85 | v207.01,38.1 205.74,36.83 185.42,36.83 184.15,35.56 184.15,32.61 X1.4
GND  (via drill 0.5, 0.6, 1.3)
  Top 0.305: C9.1 C8.1 | IC5.1 134.62,27.94 137.16,27.94 138.43,29.21 141.81,29.21 S1.1 | S1.1 142.16,32.31 C6.2 141.1,34.8 130.45,34.8 127.15,38.1 VIA0.1 124.71,38.1 v119.79,43.03 | J3.2 150.19,30.15 149.66,29.62 142.22,29.62 S1.1 | C7.1 158.7,37.54 v154.53,37.54 148.03,37.54 CPU.1
  Top 0.406: CPU.21 134.62,85.09 137.16,82.55 v137.16,39.37 | R7.P$1 173.13,38.1 v173.13,36.32 | v169.88,49.23 170.69,50.04 174.65,50.04 175.26,50.65 RAM.14 | IC1.15 193.04,44.96 v192.94,44.86 | v190.19,44.86 186.84,44.86 186.84,40.79 IC3.7
  Top 2.184: J1.GND 209.01,26.75 J1.GNDBREAK 217.71,29.75 219.71,31.75 IC4.GND
  Bottom 0.305: R8.P$1 162.61,29.16 C3.1 C4.1 | R5.P$2 IC2.7 | R5.P$2 R7.P$1 | v119.79,43.03 116.13,39.37 106.68,39.37 VIA1.1 106.68,36.83 v106.68,35.56 | CPU.1 148.59,36.83 150.47,38.71 | C4.1 160.07,36.12 C7.1 | C4.1 164.59,35.56 166.37,35.56 167.64,36.83 R5.P$2 | J3.2 153.62,32.05 154.53,32.97 v154.53,37.54 | X1.9 182.84,31.14 X1.5 | IC1.15 193.19,48.26 194.77,46.69 206.65,46.69 206.96,46.99 206.96,49.43 207.26,49.73 207.57,49.73 208.18,50.34 209.09,50.34 ACIA.1 211.63,52.07 C5.2
  Bottom 0.406: v137.16,39.37 144.78,39.37 CPU.1 | v173.13,36.32 177.67,36.32 X1.5 | IC2.7 168.91,41.91 168.91,48.26 v169.88,49.23 | v192.94,44.86 v190.19,44.86
  pour Bottom: 87.63,88.9 arc90 86.36,87.63 86.36,22.86 arc90 87.63,21.59 225.45,21.59 arc90 226.77,22.91 226.77,86.92 arc90 224.79,88.9
IRQ  (via drill 0.6)
  Top 0.305: IC3.13 IC3.12 176.48,48.31 176.48,50.65 177.7,51.87 v177.7,54.3
  Top 0.406: v109.12,78.69 109.12,37.54 v109.42,37.24 | v173.43,23.22 173.43,25.35 174.35,26.26 175.26,26.26 177.39,28.4 177.39,36.02 v180.44,39.06 | v181.36,44.86 180.14,44.86 178.92,43.64 175.87,43.64 v175.56,43.94
  Bottom 0.305: ACIA.26 194.31,57.15 193.04,55.88 189.23,55.88 187.05,53.7 178.92,53.7 v177.7,54.3
  Bottom 0.406: VIA1.21 91.44,85.09 108.81,85.09 | VIA0.21 110.49,85.09 108.81,85.09 | 108.81,85.09 108.81,78.99 v109.12,78.69 | v109.42,37.24 109.42,36.93 108.81,36.32 108.81,29.01 109.73,28.09 109.73,27.79 108.81,27.18 108.81,22.91 109.42,22.3 125.27,22.3 125.58,22 172.21,22 v173.43,23.22 | v180.44,39.06 180.44,42.11 181.36,43.03 v181.36,44.86 | v175.56,43.94 175.56,47.3 IC3.12
N$1  (via drill 0.6)
  Top 0.406: v172.82,27.84 171.45,29.21 168.91,29.21 R5.P$1
  Bottom 0.406: LED1.K 224.21,48.87 224.03,48.41 224.03,33.88 223.11,32.97 211.23,32.97 208.18,29.92 206.35,29.92 203.61,27.18 172.82,27.18 v172.82,27.84
N$2  (via drill 0.6)
  Top 0.305: Q1.2 159.59,31.52 C3.2 | CPU.3 147.42,41.91 150.57,38.1 157.58,38.15 v158.19,38.46
  Bottom 0.305: v158.19,38.46 158.19,32.92 C3.2 | Q1.2 156.44,31.52 R1.P$1
N$3
  Top 0.305: X1.3 187,38.3 187.76,39.06 187.76,43.33 188.37,43.94 195.07,43.94 195.68,44.55 195.68,48.16 IC1.14
N$4  (via drill 3.2)
  other vias: 97.84,81.74
N$5  (via drill 0.6)
  Top 0.305: v188.67,53.09 194.56,53.09 ACIA.28
  Top 0.406: v149.66,49.73 150.57,49.73 151.18,50.34 156.06,50.34 156.97,51.26 165.51,51.26 167.34,53.09 171.91,53.09 v172.52,52.48
  Bottom 0.305: v172.52,52.48 173.43,52.48 174.04,53.09 176.48,53.09 177.09,52.48 188.06,52.48 v188.67,53.09
  Bottom 0.406: CPU.34 132.99,52.07 133.81,51.26 141.73,51.26 142.04,51.56 143.56,51.56 144.78,50.34 146,50.34 146.3,50.65 148.13,50.65 v149.66,49.73
N$6  (via drill 0.6)
  Top 0.305: IC5.2 135.91,23.5 140.61,23.5 S1.3 150.27,25.04 151.13,25.91 151.13,29.21 152.4,30.48 152.4,34.29 152.09,34.59 J3.1
  Top 0.406: v176.17,34.8 175.26,34.8 174.65,34.19 172.21,34.19 170.69,32.66 v167.64,32.66 | v164.9,32.66 164.9,35.71 162.15,38.46 159.72,38.46 158.8,39.37 158.8,42.42 158.19,43.03 155.14,43.03 153.62,41.5 v153.62,39.06
  Bottom 0.305: R3.P$1 215.19,56.59 214.63,57.15 214.17,57.15 C5.1
  Bottom 0.406: R3.P$1 215.19,47.6 213.97,46.38 213.97,38.76 213.06,37.85 208.48,37.85 203,32.36 203,29.01 201.78,27.79 181.97,27.79 178.61,31.14 178.61,33.58 178.31,33.88 177.09,33.88 v176.17,34.8 | v167.64,32.66 v164.9,32.66 | v153.62,39.06 153.62,38.02 J3.1
N$7  (via drill 0.6)
  Top 0.305: v203.2,74.93 v203.2,66.04
  Bottom 0.305: ACIA.10 v203.2,74.93 | v203.2,66.04 IC1.11
N$8  (via drill 0.6)
  Top 0.305: v201.17,67.11 201.17,68.33 200.86,68.63 v200.86,78.08
  Bottom 0.305: IC1.12 200.66,66.6 v201.17,67.11 | v200.86,78.08 208.89,78.08 ACIA.12
N$9
  Bottom 0.305: IC1.3 195.58,41.1 197.21,42.72 209.4,42.72 210.62,41.5 210.62,40.72 C1.2
N$10
  Bottom 0.305: IC1.1 190.5,41.91 191.77,43.18 210.95,43.18 C1.1
N$11  (via drill 0.6)
  Top 0.305: v200.86,43.94 200.86,40.84 IC1.5
  Bottom 0.305: C2.2 210.44,45.59 210.01,45.16 210.01,44.55 209.4,43.94 v200.86,43.94
N$12  (via drill 0.6)
  Top 0.305: IC1.4 198.12,43.03 v199.64,44.86
  Bottom 0.305: v199.64,44.86 208.79,44.86 209.4,45.47 209.4,47.9 209.7,48.21 211.91,48.21 C2.1
N$13  (via drill 0.5)
  Top 0.305: IC2.4 160.02,43.81 160.66,44.76 v177.8,44.76 | v177.8,66.04 177.8,63.5 179.07,62.23 179.07,50.8 178.74,50.8 v177.8,49.86
  Bottom 0.305: v177.8,44.76 v177.8,49.86 | v177.8,66.04 170.18,66.04 ROM.20
N$14  (via drill 0.6)
  Top 0.305: ROM.22 v159.38,69.85
  Bottom 0.305: IC2.2 154.94,42.55 158.75,46.35 158.75,69.22 v159.38,69.85
N$15  (via drill 0.6)
  Top 0.305: VIA1.23 88.9,81.28 87.63,80.01 v87.63,54.61 | 169.54,34.29 171.45,34.29 v172.09,34.92
  Top 0.406: 169.54,34.29 v168.91,34.29 171.45,34.29 | v90.22,22.91 v126.8,22.91
  Bottom 0.305: v87.63,54.61 87.63,53.98 87,53.34 87,23.5 87.33,23.16 | v172.09,34.92 172.09,36.83 173.35,38.1 183.51,38.1 184.15,38.73 IC3.6 | 151.51,23.16 152.43,24.08 166.32,24.08 v168.28,26.04
  Bottom 0.406: v168.28,26.04 168.91,26.67 v168.91,34.29 | 87.33,23.16 89.97,23.16 v90.22,22.91 | v126.8,22.91 151.26,22.91 151.51,23.16
N$16
  Top 0.305: IC3.8 186.69,49.53 187.66,50.49 196.85,50.49 198.73,52.07 208.08,52.07 209.09,53.09 209.09,56.44 209.7,57.05 210.72,57.05 ACIA.3
N$17  (via drill 0.6)
  Top 0.305: IC3.3 176.53,39.37 173.99,36.83 | v171.6,23.52 171.3,23.22 166.42,23.22 165.51,22.3 130.45,22.3 129.84,22.91 129.84,26.87 128.32,28.4 v108.2,28.4 | v108.2,38.15 108.2,79.91 109.88,81.28
  Top 0.406: v173.99,35.05 173.99,36.83 | 109.88,81.28 VIA0.23
  Bottom 0.305: v108.2,28.4 v108.2,38.15
  Bottom 0.406: v171.6,23.52 171.6,33.17 172.72,34.29 173.23,34.29 v173.99,35.05
N$18
  Top 0.305: Q1.1 156.46,36.32 C4.2 | R1.P$2 153.67,29.21 153.67,35.46 154.53,36.32 156.19,36.32 Q1.1 | CPU.37 133.35,44.45 134.62,43.18 134.62,36.83 135.89,35.56 148.59,35.56 149.22,36.2 156.06,36.2 Q1.1
N$19
  Bottom 0.305: IC5.5 140.97,34.29 143.51,34.29 C6.1
N$20
  Bottom 2.184: J1.PWR 207.31,33.33 209.55,35.56 220.98,35.56 222.25,36.83 IC4.IN 222.25,41.91
N$21  (via drill 0.6)
  Top 0.305: v119.79,53.09 121.61,53.09 v122.22,53.7 | v144.78,54.61 144.78,48.51 145.09,48.21 150.57,48.21 151.18,47.6 151.18,46.99 151.79,46.38 166.42,46.38 167.64,47.6 IC2.8
  Bottom 0.305: VIA0.34 119.53,53.34 v119.79,53.09 | v122.22,53.7 123.14,54.61 127.71,54.61 128.63,53.7 140.21,53.7 141.12,54.61 v144.78,54.61
N$22
  Top 0.305: C7.2 162.61,35.87 161.54,34.8 161.54,29.62 161.24,29.31 156.29,29.31 D1.A
  Bottom 0.305: R4.P$1 164.44,37.44 C7.2 | 135.89,33.02 IC5.7 | IC5.6 135.89,33.02 | 135.89,33.02 135.89,23.82 136.22,23.5 149.22,23.5 151.13,25.4 152.38,25.4 D1.A
N$23
  Bottom 0.305: IC5.4 140.97,26.67 161.29,26.67 R2.P$1
N$24
  Top 0.305: IC2.6 166.37,39.37 166.37,24.13 165.1,22.86 131.44,22.86 130.5,23.5 130.5,27.3 128.29,29.21 88.27,29.21 87.63,29.84 87.63,52.07 88.9,53.34 VIA1.34
N$25  (via drill 3.2)
  other vias: 219.76,25.65
N$26  (via drill 0.6)
  Top 0.305: IC2.10 162.56,49.53 163.37,50.34 169.47,50.34 170.38,51.26 v171.91,51.26 | ACIA.4 209.55,59.69 208.28,58.42 208.28,53.34 207.72,52.78 198.43,52.78 196.6,50.95 189.59,50.95 188.98,51.56 v185.32,51.56
  Bottom 0.305: v185.32,51.56 177.09,51.56 176.48,50.95 172.21,50.95 v171.91,51.26
N$29
  Bottom 0.305: IC5.3 137.16,26.67 138.43,27.94 141.6,27.94 142.24,28.57 146.69,28.57 147.32,29.21 147.32,34.29 149.05,36.02 150.27,36.02 151.18,36.93 151.18,42.72 154.84,46.38 154.84,48.16 IC2.13
N$30
  Top 0.305: R6.P$1 224.03,61.59 Q2.2
  Bottom 0.305: ACIA.6 212.72,62.87 C8.2 215.9,61.59 220.34,61.59 R6.P$1
N$31
  Top 0.305: Q2.1 222.76,55.88 R6.P$2 C9.2 213.36,60.96 213.36,66.04 212.09,67.31 ACIA.7
N$32
  Top 0.813: IC4.OUT 217.17,44.27 S2.3
PHI2  (via drill 0.6)
  Top 0.305: CPU.39 131.98,39.37 130.15,41.2 v130.15,55.52 | v130.15,58.57 130.15,78.74 | 130.15,78.74 130.15,79.6 129.54,80.21 114.3,80.21 114,79.91 114,78.44 VIA0.25 | v177.16,83.82 167.64,83.82 166.37,82.55 156.84,82.55 155.57,83.82 146.05,83.82 v144.78,82.55 | v134.62,82.55 134.62,80.01 133.35,78.74 130.15,78.74 | v197.81,68.63 197.81,83.21 197.21,83.82 191.77,83.82 RAM.27
  Bottom 0.305: VIA1.25 102.87,76.2 104.14,74.93 110.49,74.93 VIA0.25 | v130.15,55.52 v130.15,58.57 | RAM.27 189.23,83.82 v177.16,83.82 | v144.78,82.55 v134.62,82.55 | ACIA.27 197.54,54.61 198.78,55.24 198.78,55.27 199.03,55.52 199.03,67.41 v197.81,68.63
RECEIVEDATA
  Top 0.305: X1.2 189.76,36.09 191.77,38.1 191.77,49.17 192.63,50.04 197.51,50.04 198.12,49.43 IC1.13
REQUESTTOSEND  (via drill 0.6)
  Top 0.305: X1.7 188.75,29.7 191.11,31.75 191.11,34.49 203.61,34.49 204.22,35.1 v204.22,50.95
  Bottom 0.305: v204.22,50.95 204.22,69.6 204.47,69.85 ACIA.8
RESET  (via drill 0.6)
  Top 0.305: IC2.11 IC2.12 | v153.67,43.18 144.78,43.18 v144.78,36.83
  Bottom 0.305: IC2.11 160.02,47.62 161.29,46.35 162.56,46.35 | 162.56,46.35 163.83,46.35 165.1,47.62 IC2.9 | IC2.5 162.56,46.35 | IC2.12 157.48,46.99 v153.67,43.18 | v144.78,36.83 CPU.40
VCC  (via drill 0.6, 1.3)
  Top 0.305: R4.P$2 165.1,27.94 163.83,26.67 161.29,26.67 160.35,25.73 D1.C | R3.P$2 215.19,45.16 213.36,46.99 210.62,46.99 210.01,46.08 v208.18,46.08
  Top 0.406: v135.89,43.18 v135.89,49.53 | CPU.6 147.73,49.53 148.44,48.82 151.84,48.82 IC2.14 151.76,48.9 148.59,48.9 148.59,49.53 CPU.6
  Bottom 0.305: R2.P$2 R8.P$2 R7.P$2 170.18,35.56 172.72,38.1 172.72,46.99 IC3.14 | v208.18,46.08 191.72,46.08 190.5,47.3 IC1.16
  Bottom 0.406: IC5.8 131.44,34.92 129.54,36.83 130.81,38.1 134.62,38.1 135.89,39.37 v135.89,43.18 | v135.89,49.53 CPU.6 | CPU.2 148.59,39.37 149.86,40.64 149.86,46.99 151.13,48.26 IC2.14 152.4,50.16 147.96,54.61 CPU.8 | R4.P$2 165.1,29.21 166.37,27.94 R8.P$2 | ROM.27 ROM.28
  other vias: 110.49,35.56 152.4,48.26
  pour Top: 224.79,88.9 87.63,88.9 arc90 86.36,87.63 86.36,22.86 arc90 87.63,21.59 225.15,21.59 arc90 226.77,23.22 226.77,86.92 arc90
VIA0A0
  Bottom 0.305: VIA0A.1 128.27,27.94 127,29.21 127,34.29 124.97,36.32 124.97,39.98 125.58,40.59 126.95,40.59 VIA0.2
VIA0A1
  Bottom 0.305: VIA0A.2 125.73,27.94 124.46,29.21 124.46,41.91 125.73,43.18 VIA0.3
VIA0A2
  Bottom 0.305: VIA0A.3 123.19,27.94 121.92,29.21 121.92,33.66 123.83,35.56 123.83,44.45 125.09,45.72 VIA0.4
VIA0A3
  Bottom 0.305: VIA0A.4 120.65,27.94 119.38,29.21 119.38,33.66 120.02,34.29 121.92,34.29 123.19,35.56 123.19,46.99 124.46,48.26 VIA0.5
VIA0A4
  Bottom 0.305: VIA0A.5 118.11,27.94 116.84,29.21 116.84,34.29 117.47,34.92 121.28,34.92 122.56,36.2 122.56,49.53 123.83,50.8 VIA0.6
VIA0A5
  Bottom 0.305: VIA0A.6 115.57,27.94 114.3,29.21 114.3,34.92 114.94,35.56 120.65,35.56 121.92,36.83 121.92,51.77 123.5,53.34 VIA0.7
VIA0A6
  Bottom 0.305: VIA0A.7 113.03,27.94 111.76,29.21 111.76,33.66 113.03,34.92 113.03,35.56 113.67,36.2 120.02,36.2 121.28,37.47 121.28,54.61 122.56,55.88 VIA0.8
VIA0A7
  Bottom 0.305: VIA0A.8 110.49,27.91 109.22,29.49 109.22,33.66 109.86,34.29 111.76,34.29 112.39,34.92 112.39,36.2 113.03,36.83 119.38,36.83 120.65,38.1 120.65,57.15 121.92,58.42 VIA0.9
VIA0A8
  Bottom 0.305: 104.14,25.4 104.14,27.94 102.87,29.21 102.87,41.91 104.14,43.18 105.41,43.18
VIA0A9
  Bottom 0.305: 101.6,25.4 101.6,27.94 100.33,29.21 100.33,33.66 102.23,35.56 102.23,44.45 103.5,45.72 105.41,45.72
VIA0A10
  Bottom 0.305: 99.06,25.4 99.06,27.94 97.79,29.21 97.79,33.66 98.42,34.29 100.33,34.29 101.6,35.56 101.6,46.99 102.87,48.26 105.41,48.26
VIA0A11
  Bottom 0.305: 96.52,25.4 96.52,27.94 95.25,29.21 95.25,34.29 95.89,34.92 99.69,34.92 100.97,36.2 100.97,49.53 102.23,50.8 105.41,50.8
VIA0A12
  Bottom 0.305: 93.98,25.4 93.98,27.94 92.71,29.21 92.71,34.92 93.34,35.56 99.06,35.56 100.33,36.83 100.33,52.07 101.6,53.34 105.41,53.34
VIA0A13
  Bottom 0.305: 105.41,55.88 100.97,55.88 99.69,54.61 99.69,37.47 98.42,36.2 90.81,36.2 90.17,35.56 90.17,29.21 91.44,27.94 91.44,25.4
VIA0A14
  Bottom 0.305: 88.9,25.4 88.9,27.3 87.63,28.57 87.63,36.2 88.27,36.83 97.79,36.83 99.06,38.1 99.06,57.15 100.33,58.42 105.41,58.42
VIA0B0
  Top 0.305: VIA0.10 119.38,60.96 118.75,60.33 118.75,42.55 128.27,33.02 VIA0B.1
VIA0B1
  Top 0.305: VIA0B.2 125.73,33.02 118.11,40.64 118.11,62.23 119.38,63.5 VIA0.11
VIA0B2
  Top 0.305: VIA0.12 118.11,66.04 117.47,65.41 117.47,40.01 123.19,34.29 VIA0B.3
VIA0B3
  Top 0.305: VIA0B.4 120.65,34.29 116.84,38.1 116.84,67.31 118.11,68.58 VIA0.13
VIA0B4
  Top 0.305: VIA0.14 116.84,71.12 116.2,70.48 116.2,37.47 118.11,35.56 VIA0B.5
VIA0B5
  Top 0.305: VIA0B.6 115.57,72.39 116.84,73.66 VIA0.15
VIA0B6
  Top 0.305: VIA0.16 115.57,76.2 114.94,75.56 114.94,37.47 113.03,35.56 VIA0B.7
VIA0B7
  Top 0.305: VIA0.17 115.57,78.74 114.3,77.47 114.3,38.1 112.39,36.2 112.39,34.92 111.12,33.66 111.12,32.38 VIA0B.8
VIA1A0
  Bottom 0.305: VIA1.2 104.14,40.64 103.5,40.01 103.5,36.2 105.41,34.29 105.41,29.21 106.68,27.94 VIA1A.1
VIA1A1
  Bottom 0.305: VIA1A.2 104.14,27.94 102.87,29.21 102.87,41.91 104.14,43.18 VIA1.3
VIA1A2
  Bottom 0.305: VIA1.4 103.5,45.72 102.23,44.45 102.23,35.56 100.33,33.66 100.33,29.21 101.6,27.94 VIA1A.3
VIA1A3
  Bottom 0.305: VIA1A.4 99.06,27.94 97.79,29.21 97.79,33.66 98.42,34.29 100.33,34.29 101.6,35.56 101.6,46.99 102.87,48.26 VIA1.5
VIA1A4
  Bottom 0.305: VIA1.6 102.23,50.8 100.97,49.53 100.97,36.2 99.69,34.92 95.89,34.92 95.25,34.29 95.25,29.21 96.52,27.94 VIA1A.5
VIA1A5
  Bottom 0.305: VIA1A.6 93.98,27.94 92.71,29.21 92.71,34.92 93.34,35.56 99.06,35.56 100.33,36.83 100.33,52.07 101.6,53.34 VIA1.7
VIA1A6
  Bottom 0.305: VIA1.8 100.97,55.88 99.69,54.61 99.69,37.47 98.42,36.2 90.81,36.2 90.17,35.56 90.17,29.21 91.44,27.94 VIA1A.7
VIA1A7
  Bottom 0.305: VIA1A.8 88.9,27.3 87.63,28.57 87.63,36.2 88.27,36.83 97.79,36.83 99.06,38.1 99.06,57.15 100.33,58.42 VIA1.9
VIA1A15
  Bottom 0.305: 128.27,25.4 128.27,27.94 127,29.21 127,34.29 125.09,36.2 125.09,40.01 125.73,40.64 127,40.64
VIA1A23
  Bottom 0.305: 128.27,25.4 128.27,27.94 127,29.21 127,34.29 125.09,36.2 125.09,40.01 125.73,40.64 127,40.64
VIA1A40
  Bottom 0.305: 106.68,25.4 106.68,27.94 105.41,29.21 105.41,34.29 103.5,36.2 103.5,40.01 104.14,40.64 105.41,40.64
VIA1A41
  Bottom 0.305: 106.68,25.4 106.68,27.94 105.41,29.21 105.41,34.29 103.5,36.2 103.5,40.01 104.14,40.64 105.41,40.64
VIA1B0
  Top 0.305: VIA1B.1 106.68,33.02 97.16,42.55 97.16,60.33 97.79,60.96 VIA1.10
VIA1B1
  Top 0.305: VIA1B.2 104.14,33.02 96.52,40.64 96.52,62.23 97.79,63.5 VIA1.11
VIA1B2
  Top 0.305: VIA1.12 96.52,66.04 95.89,65.41 95.89,40.01 101.6,34.29 VIA1B.3
VIA1B3
  Top 0.305: VIA1B.4 99.06,34.29 95.25,38.1 95.25,67.31 96.52,68.58 VIA1.13
VIA1B4
  Top 0.305: VIA1.14 95.25,71.12 94.61,70.48 94.61,37.47 96.52,35.56 VIA1B.5
VIA1B5
  Top 0.305: VIA1B.6 93.98,72.39 95.25,73.66 VIA1.15
VIA1B6
  Top 0.305: VIA1.16 93.98,76.2 93.34,75.56 93.34,37.47 91.44,35.56 VIA1B.7
VIA1B7
  Top 0.305: VIA1B.8 88.9,34.29 92.71,38.1 92.71,77.47 93.98,78.74 VIA1.17
VIA1B8
  Top 0.305: 128.27,31.75 128.27,33.02 118.75,42.55 118.75,60.33 119.38,60.96 127,60.96
VIA1B9
  Top 0.305: 127,63.5 119.38,63.5 118.11,62.23 118.11,40.64 125.73,33.02 125.73,31.75
VIA1B10
  Top 0.305: 123.19,31.75 123.19,34.29 117.47,40.01 117.47,65.41 118.11,66.04 127,66.04
VIA1B11
  Top 0.305: 127,68.58 118.11,68.58 116.84,67.31 116.84,38.1 120.65,34.29 120.65,31.75
VIA1B12
  Top 0.305: 118.11,31.75 118.11,35.56 116.2,37.47 116.2,70.48 116.84,71.12 127,71.12
VIA1B13
  Top 0.305: 127,73.66 116.84,73.66 115.57,72.39 115.57,31.75
VIA1B14
  Top 0.305: 113.03,31.75 113.03,35.56 114.94,37.47 114.94,75.56 115.57,76.2 127,76.2
VIA1B16
  Top 0.305: 127,60.96 119.38,60.96 118.75,60.33 118.75,42.55 128.27,33.02 128.27,31.75
VIA1B17
  Top 0.305: 125.73,31.75 125.73,33.02 118.11,40.64 118.11,62.23 119.38,63.5 127,63.5
VIA1B18
  Top 0.305: 127,66.04 118.11,66.04 117.47,65.41 117.47,40.01 123.19,34.29 123.19,31.75
VIA1B19
  Top 0.305: 120.65,31.75 120.65,34.29 116.84,38.1 116.84,67.31 118.11,68.58 127,68.58
VIA1B20
  Top 0.305: 127,71.12 116.84,71.12 116.2,70.48 116.2,37.47 118.11,35.56 118.11,31.75
VIA1B21
  Top 0.305: 115.57,31.75 115.57,72.39 116.84,73.66 127,73.66
VIA1B22
  Top 0.305: 127,76.2 115.57,76.2 114.94,75.56 114.94,37.47 113.03,35.56 113.03,31.75
VIA1B24
  Top 0.305: 106.68,31.75 106.68,33.02 97.16,42.55 97.16,60.33 97.79,60.96 105.41,60.96
VIA1B25
  Top 0.305: 105.41,63.5 97.79,63.5 96.52,62.23 96.52,40.64 104.14,33.02 104.14,31.75
VIA1B26
  Top 0.305: 101.6,31.75 101.6,34.29 95.89,40.01 95.89,65.41 96.52,66.04 105.41,66.04
VIA1B27
  Top 0.305: 105.41,68.58 96.52,68.58 95.25,67.31 95.25,38.1 99.06,34.29 99.06,31.75
VIA1B28
  Top 0.305: 96.52,31.75 96.52,35.56 94.61,37.47 94.61,70.48 95.25,71.12 105.41,71.12
VIA1B29
  Top 0.305: 105.41,73.66 95.25,73.66 93.98,72.39 93.98,31.75
VIA1B30
  Top 0.305: 91.44,31.75 91.44,35.56 93.34,37.47 93.34,75.56 93.98,76.2 105.41,76.2
VIA1B31
  Top 0.305: 105.41,78.74 93.98,78.74 92.71,77.47 92.71,38.1 88.9,34.29 88.9,31.75
VIA1B32
  Top 0.305: 105.41,60.96 97.79,60.96 97.16,60.33 97.16,42.55 106.68,33.02 106.68,31.75
VIA1B33
  Top 0.305: 104.14,31.75 104.14,33.02 96.52,40.64 96.52,62.23 97.79,63.5 105.41,63.5
VIA1B34
  Top 0.305: 105.41,66.04 96.52,66.04 95.89,65.41 95.89,40.01 101.6,34.29 101.6,31.75
VIA1B35
  Top 0.305: 99.06,31.75 99.06,34.29 95.25,38.1 95.25,67.31 96.52,68.58 105.41,68.58
VIA1B36
  Top 0.305: 105.41,71.12 95.25,71.12 94.61,70.48 94.61,37.47 96.52,35.56 96.52,31.75
VIA1B37
  Top 0.305: 93.98,31.75 93.98,72.39 95.25,73.66 105.41,73.66
VIA1B38
  Top 0.305: 105.41,76.2 93.98,76.2 93.34,75.56 93.34,37.47 91.44,35.56 91.44,31.75
VIA1B39
  Top 0.305: 88.9,31.75 88.9,34.29 92.71,38.1 92.71,77.47 93.98,78.74 105.41,78.74
(copper drawn outside any net)
  shapes: Top area x648

### Text on the board
tPlace: OFF | ON | JP1 | Benchoff Mar 2013 | RESET